# Altium schematic sheet ESP32-S3.SchDoc
size A; SheetNumber: 7; SheetTotal: 11
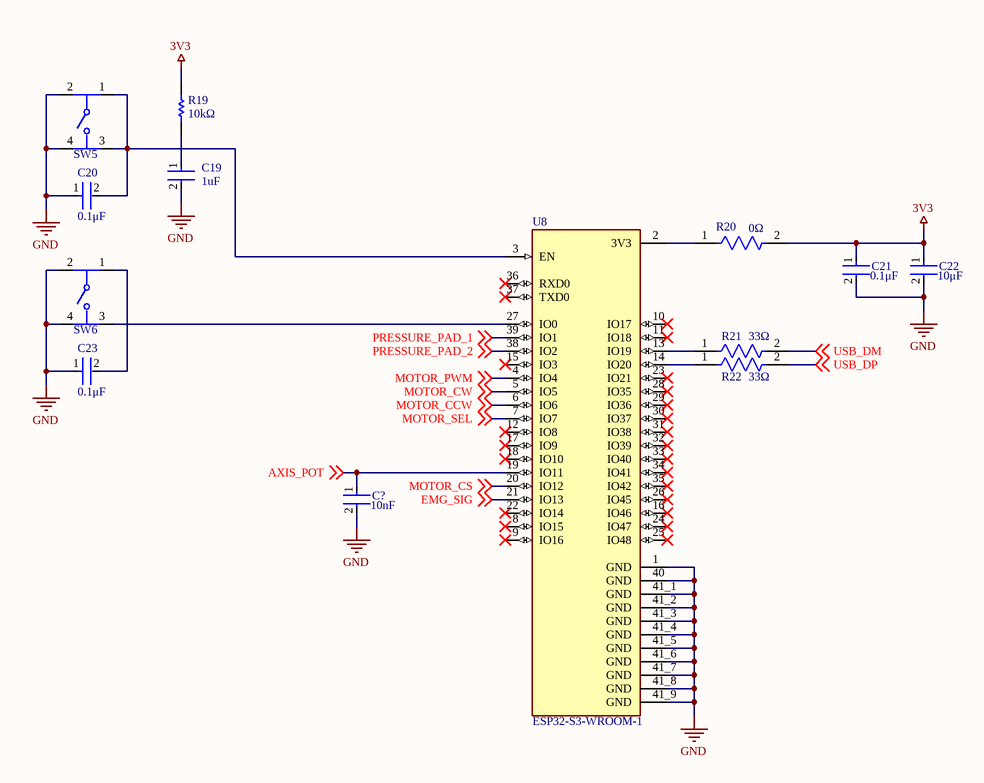
[diagram p0: ESP32-S3.SchDoc]

## Parts
C19  Capacitance: 1uF  [FP-CC0805-0_85-MFG]  (hidden comment: CC0805MKX7R7BB105)
C20  Capacitance: 0.1μF  [FP-C0805C-DN-MFG]  (hidden comment: C0805C104K8RACTU)
C21  Capacitance: 0.1μF  [FP-C0805C-DN-MFG]  (hidden comment: C0805C104K8RACTU)
C22  Capacitance: 10μF  [FP-GRT21B-0_2-IPC_B]  (hidden comment: GRT21BC71E106KE13L)
C23  Capacitance: 0.1μF  [FP-C0805C-DN-MFG]  (hidden comment: C0805C104K8RACTU)
C?  Capacitance: 10nF  [FP-C0805C103K8RACAUTO-MFG]  (hidden comment: C0805C103K8RACAUTO)
R19  Resistance: 10kΩ  [RESC2013X60X35NL10T20]  (hidden comment: RC0805JR-1310KL)
R20  Resistance: 0Ω  [FP-RCC0805-e3-MFG]  (hidden comment: RCC08050000Z0EA)
R21  Resistance: 33Ω  [FP-AC0805-MFG]  (hidden comment: AC0805FR-0733RL)
R22  Resistance: 33Ω  [FP-AC0805-MFG]  (hidden comment: AC0805FR-0733RL)
SW5  TL1105AF160Q  [FP-TL1105AF160Q-MFG]  (value not drawn)
SW6  TL1105AF160Q  [FP-TL1105AF160Q-MFG]  (value not drawn)
U8  ESP32-S3-WROOM-1  [ESP32-S3-WROOM-1]

## Nets
3V3: C21.1 C22.1 R19.2 R20.2
GND: C19.2 C20.1 C21.2 C22.2 C23.1 C?.2 SW5.2 SW5.4 SW6.2 SW6.4 U8.1(GND) U8.40(GND) U8.41_1(GND) U8.41_2(GND) U8.41_3(GND) U8.41_4(GND) U8.41_5(GND) U8.41_6(GND) U8.41_7(GND) U8.41_8(GND) U8.41_9(GND)
AXIS_POT: C?.1 U8.19(IO11) ; off-sheet AXIS_POT
EMG_SIG: U8.21(IO13) ; off-sheet EMG_SIG
MOTOR_CCW: U8.6(IO6) ; off-sheet MOTOR_CCW
MOTOR_CS: U8.20(IO12) ; off-sheet MOTOR_CS
MOTOR_CW: U8.5(IO5) ; off-sheet MOTOR_CW
MOTOR_PWM: U8.4(IO4) ; off-sheet MOTOR_PWM
MOTOR_SEL: U8.7(IO7) ; off-sheet MOTOR_SEL
PRESSURE_PAD_1: U8.39(IO1) ; off-sheet PRESSURE_PAD_1
PRESSURE_PAD_2: U8.38(IO2) ; off-sheet PRESSURE_PAD_2
USB_DM: R21.2 ; off-sheet USB_DM
USB_DP: R22.2 ; off-sheet USB_DP
NetC19_1: C19.1 R19.1
NetC20_2: C20.2 SW5.1 SW5.3 U8.3(EN)
NetC23_2: C23.2 SW6.1
NetR20_1: R20.1 U8.2(3V3)
NetR21_1: R21.1 U8.13(IO19)
NetR22_1: R22.1 U8.14(IO20)
NetSW6_3: SW6.3 U8.27(IO0)

Not connected (* = marked no-connect by the designer): U8 8(IO15)* 9(IO16)* 10(IO17)* 11(IO18)* 12(IO8)* 15(IO3)* 16(IO46)* 17(IO9)* 18(IO10)* 22(IO14)* 23(IO21)* 24(IO47)* 25(IO48)* 26(IO45)* 28(IO35)* 29(IO36)* 30(IO37)* 31(IO38)* 32(IO39)* 33(IO40)* 34(IO41)* 35(IO42)* 36(RXD0)* 37(TXD0)*

## Library data of the parts
C19 = CMP-03422-001156-1: CAP CER 1UF 16V X7R 0805; Manufacturer: Yageo; Material: Ceramic; Tolerance: 0.2; Octopart: https://octopart.com/cc0805mkx7r7bb105-yageo-33242308; Footprint Url: http://www.yageo.com/exep/pages/download/literatures/UPY-C_GEN_24.pdf; Height: 0.95mm; Manufacturer Part Number: CC0805MKX7R7BB105; ComponentLink2Description: Datasheet; Device Class L2: Capacitors; Package: CC0805-0.85; RoHS: TRUE; Category: Cap; Device Class L1: Passive Components; Device Class L3: Ceramic Capacitors; Ipc Land Pattern Name: CAPC200125X85; Temperature Range Low: -30°C; ComponentLink2URL: http://www.yageo.com/documents/recent/UPY-GPHC_Y5V_6.3V-to-50V_8.pdf; Temperature: -30°C to +85°C; Automotive: No; Temperature Range High: +85°C; Mouser Description: Multilayer Ceramic Capacitors MLCC - SMD/SMT 1.0uF 16V X7R 20%; Digikey Description: CAP CER 1UF 16V X7R 0805; Voltage Rating: 16 V; Value: 1 uF; Lead Free: Yes; Temperature Characteristic: X7R
C20 C21 C23 = CMP-2007-00281-2: CAP CER 0.1UF 10V 10% X7R 0805; Manufacturer: KEMET; Temperature Coefficient: 30ppm/°C; Tolerance: 0.1; Material: Ceramic; Value: 0.10 μF; Ipc Land Pattern Name: CAPC200125X78; Voltage Rating: 10 V; Temperature: -55°C to +125°C; Octopart: https://octopart.com/c0805c104k8ractu-kemet-9139201; RoHS: TRUE; Category: Cap; Temperature Range High: +125°C; Device Class L1: Passive Components; Manufacturer Part Number: C0805C104K8RACTU; Mouser Description: Multilayer Ceramic Capacitors MLCC - SMD/SMT 10volts 0.1uF X7R 10%; Device Class L2: Capacitors; Automotive: No; Temperature Range Low: -55°C; Temperature Characteristic: X7R; Lead Free: Yes; Device Class L3: Ceramic Capacitors; Height: 0.88mm; ComponentLink2URL: https://content.kemet.com/datasheets/KEM_C1003_C0G_SMD.pdf; Digikey Description: CAP CER 0.1UF 10V 10% X7R 0805; Package: C0805C-DN; ComponentLink2Description: Datasheet
C22 = CMP-06035-008164-1: Multi-Layer Ceramic Capacitor 10uF 25V X7S ±10% 0805 Emboss T/R
C? = CMP-00212-126448506-1: C0805C103K8RACAUTO Cap, 0.01UF, 10V, Mlcc, 0805 Rohs Compliant: Yes; Material: Ceramic; Dielectric: X7R; Tolerance: 10%; Height: 880µm; NexarPartId: 126448506; Voltage Rating: 10V; Voltage Rating (DC): 10V; Min Operating Temperature: -55°C; Max Operating Temperature: 125°C; Case/Package: 0805; RoHS: Compliant
R19 = CMP-2001-01415-1: Manufacturer: Yageo; Part Number: RC0805JR-1310KL
R20 = CMP-00030-108211984-1: RCC08050000Z0EA Res Thick Film 0805 0 Ohm Conformal Coated Pad SMD Automotive AEC-Q200 T/R; Voltage Rating: 200V; Power Rating: 250mW; Composition: Thick Film; Max Operating Temperature: 155°C; Case/Package: 0805; Height: 500µm; NexarPartId: 108211984; Min Operating Temperature: -55°C
R21 R22 = CMP-03412-037241-1: RES SMD 33 OHM 1% 1/8W 0805; Manufacturer: Yageo; Automotive Grade: Grade 0; Value: 33Ω; Voltage Rating: 150V; Tolerance: 0.01; Octopart: https://octopart.com/ac0805fr-0733rl-yageo-46503501; Device Class L2: Resistors; Temperature: -55°C to +155°C; Composition: Thick Film; ComponentLink2URL: http://www.yageo.com/documents/recent/PYu-AC_51_RoHS_L_6.pdf; Automotive: Yes; Lead Free: Yes; Category: Res; Package: AC0805; Temperature Range Low: -55°C; Device Class L3: Chip SMD Resistors; Temperature Range High: +155°C; Mouser Description: Thick Film Resistors - SMD 1/8W 33ohm 1% AEC-Q200; Footprint Url: http://www.yageo.com/exep/pages/download/literatures/PYu-R_Mount_10.pdf; Power Rating: 1/8W; RoHS: TRUE; ComponentLink2Description: Datasheet; Device Class L1: Passive Components; Height: 0.6mm; Series: AC; Digikey Description: RES SMD 33 OHM 1% 1/8W 0805; Ipc Land Pattern Name: RESC200125X50; Manufacturer Part Number: AC0805FR-0733RL
SW5 SW6 = CMP-17879-000016-1: SWITCH TACTILE SPST-NO 0.05A 12V; Mechanical Life: 100000Cycles; Contact Current Rating: 50mA; Contact Resistance: 100mR; Switch Function: Off-Mom; Actuator Type: Standard; Actuator Length: 1.4mm; Max Voltage Rating (DC): 50V; Throw Configuration: SPST; Actuator Material: Nylon; Illumination Type: Non-Illuminated; Switch Travel: 0.25mm; Operating Force: 160gf; Package Quantity: 750; Width: 6mm; Series: TL1105; Voltage Rating (DC): 12V; Length: 6mm; Contact Plating: Silver; Color: Black; Housing Material: Nylon; Min Operating Temperature: -20°C; Lead Free: Lead Free; Mount: Through Hole; Termination: PC Pin; RoHS Compliant: Yes; Orientation: Straight; Max Operating Temperature: 70°C; Reach SVHC Compliant: Yes; Packaging: Bulk; Electrical Life: 100000Cycles; Current Rating: 50mA; Contact Material: Bronze; Size: 6mm
U8 = ESP32-S3-WROOM-1: MF: {'manufacturer': u'Espressif Systems'}; MP: ESP32-S3-WROOM-1-N8; Package: None; Price: None; Value: *; Availability: Unavailable; Supplier 1: DigiKey; Supplier Part Number 1: 5407-ESP32-S3-WROOM-1-N8CT-ND